# EAGLE design m1k-input-divider (EAGLE 7.7.0)
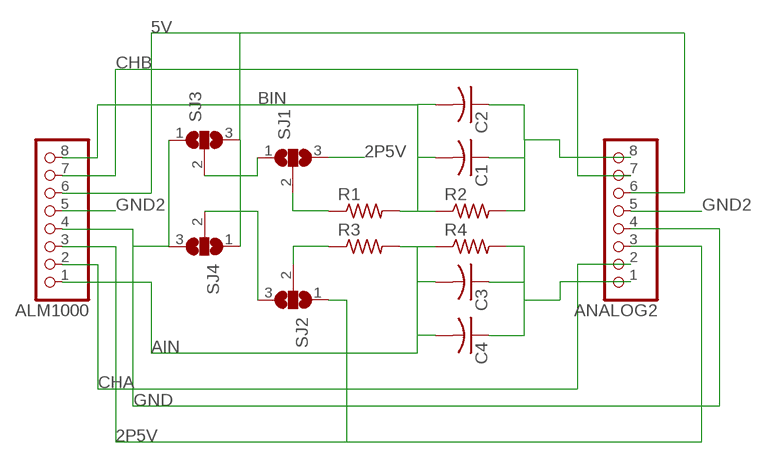
[diagram p0: schematic, sheet 1]

## Parts
ALM1000  PINHD-1X8  [1X08]
ANALOG2  PINHD-1X8  [1X08]
C1  C-US050-024X044  [C050-024X044]
C2  C-US050-024X044  [C050-024X044]
C3  C-US050-024X044  [C050-024X044]
C4  C-US050-024X044  [C050-024X044]
R1  R-US_0204/7  [0204/7]
R2  R-US_0204/7  [0204/7]
R3  R-US_0204/7  [0204/7]
R4  R-US_0204/7  [0204/7]
SJ1  SJ2W  [SJ_2]
SJ2  SJ2W  [SJ_2]
SJ3  SJ2W  [SJ_2]
SJ4  SJ2W  [SJ_2]

## Nets
2P5V: ALM1000.3 ANALOG2.3 SJ1.3 SJ2.1
5V: ALM1000.6 ANALOG2.6 SJ3.3 SJ4.1
AIN: ALM1000.1 C3.2 C4.2 R3.2 R4.1
BIN: ALM1000.8 C1.2 C2.2 R1.2 R2.1
CHA: ALM1000.2 ANALOG2.2
CHB: ALM1000.7 ANALOG2.7
GND: ALM1000.4 ANALOG2.4 SJ3.1 SJ4.3
GND2: ALM1000.5 ANALOG2.5
N$1: SJ1.1 SJ3.2
N$2: SJ2.3 SJ4.2
N$3: ANALOG2.1 C3.1 C4.1 R4.2
N$4: R1.1 SJ1.2
N$5: R3.1 SJ2.2
N$7: ANALOG2.8 C1.1 C2.1 R2.2

## Library data of the parts
ALM1000 ANALOG2 = pinhead:PINHD-1X8: PIN HEADER
C1-C4 = resistor:C-US: CAPACITOR, American symbol
R1-R4 = resistor:R-US_: RESISTOR, American symbol
SJ1-SJ4 = jumper:SJ2W: SMD solder JUMPER

## Board
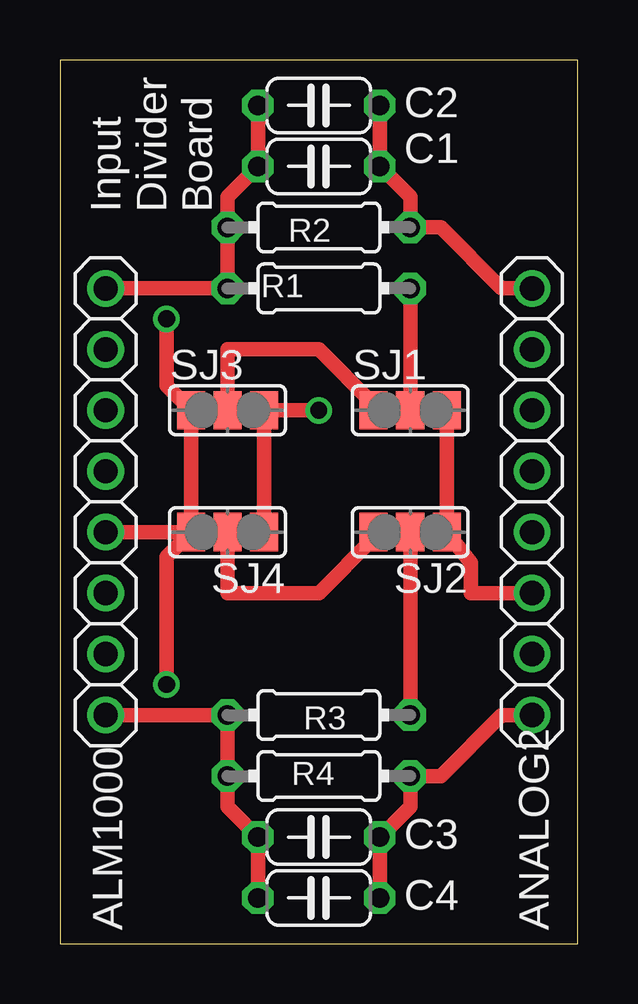
[diagram p1: board, top side]
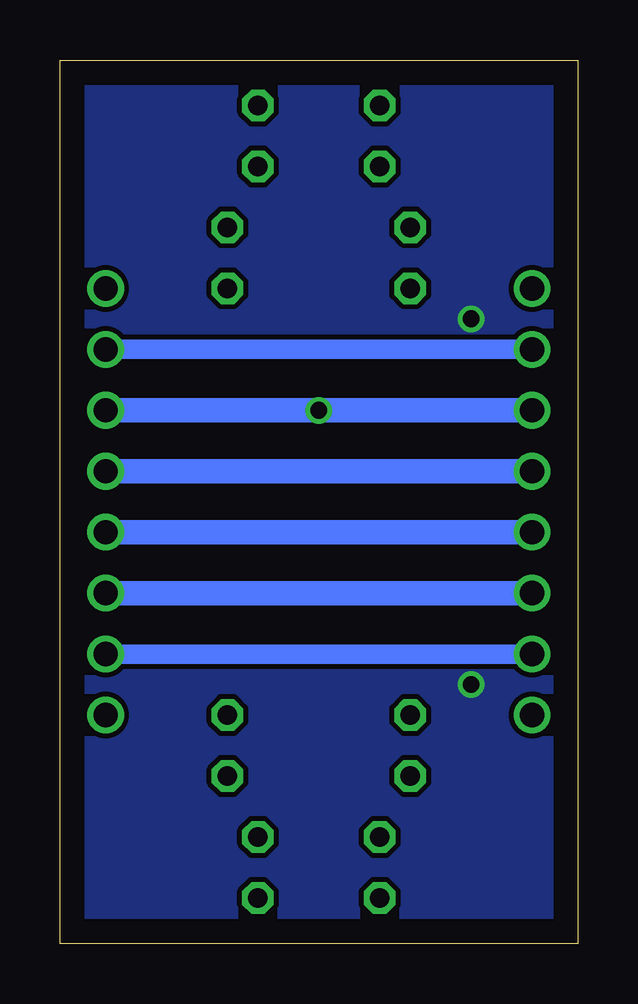
[diagram p2: board, bottom side, seen from below]

Size 21.59 x 36.82 mm. Coordinates in mm from the lower left corner, seen from the top.
Outline: 0,0 21.59,0 21.59,36.82 0,36.82 0,0
Copper layers (1*16): Top 0.035mm / dielectric 1.5mm / Bottom 0.035mm
Design rules "default": minimum track width 10mil, minimum drill 24mil, track to track 8mil, track to pad 8mil, pad to pad 8mil, via to via 8mil, smd to smd 8mil, copper to edge 40mil, drill to drill 8mil, minimum pad ring 10mil, minimum via ring 8mil, stop-mask expansion 4mil, vias tented up to drill 0mil, thermal gap 10mil

### Footprints (pad centres in the part's own frame; a part is rotated, then mirrored left to right if it is on the bottom)
1X08 = drill 1.016: 1 -8.89,0; 2 -6.35,0; 3 -3.81,0; 4 -1.27,0; 5 1.27,0; 6 3.81,0; 7 6.35,0; 8 8.89,0
C050-024X044 = drill 0.813 octagon: 1 -2.54,0; 2 2.54,0
0204/7 = drill 0.813 octagon: 1 -3.81,0; 2 3.81,0
SJ_2 = smd 1.168 x 1.6: 1 -1.524,0; 2 0,0; 3 1.524,0

### Placement (x,y rotation side)
ALM1000  1.91,18.41 90 top
ANALOG2  19.68,18.41 90 top
C1  10.79,32.38 180 top
C2  10.79,34.92 180 top
C3  10.79,4.45 180 top
C4  10.79,1.91 180 top
R1  10.79,27.3 180 top
R2  10.79,29.84 0 top
R3  10.79,9.53 180 top
R4  10.79,6.99 0 top
SJ1  14.61,22.23 0 top
SJ2  14.61,17.14 180 top
SJ3  6.99,22.23 0 top
SJ4  6.99,17.14 180 top

### Tracks (layer width: path | path; a pad name or v marks a point on that pad's centre or on a via)
2P5V
  Top 0.61: ANALOG2.3 17.14,14.61 17.14,15.88 SJ2.1 SJ1.3
  Bottom 1.016: ALM1000.3 ANALOG2.3
5V  (via drill 0.7)
  Top 0.61: v10.79,22.23 SJ3.3 SJ4.1
  Bottom 1.016: ALM1000.6 v10.79,22.23 ANALOG2.6
AIN
  Top 0.61: C4.2 C3.2 6.99,5.71 R4.1 R3.2 ALM1000.1
BIN
  Top 0.61: C2.2 C1.2 6.99,31.11 R2.1 R1.2 ALM1000.8
CHA
  Bottom 0.813: ALM1000.2 ANALOG2.2
CHB
  Bottom 0.813: ALM1000.7 ANALOG2.7
GND  (via drill 0.7)
  Top 0.61: 3.17,17.14 ALM1000.4 SJ4.3 | v4.45,10.79 4.45,16.13 SJ4.3 | SJ4.3 SJ3.1 4.45,23.24 v4.45,26.04
  Bottom 1.016: ALM1000.4 ANALOG2.4
  pour Bottom: 0.64,13.34 0.64,0.64 20.95,0.64 20.95,13.34
  pour Bottom: 0.64,36.2 0.64,23.5 20.95,23.5 20.95,36.2
GND2
  Bottom 1.016: ALM1000.5 ANALOG2.5
N$1
  Top 0.61: SJ1.1 13.08,22.48 10.79,24.77 6.99,24.77 SJ3.2
N$2
  Top 0.61: SJ2.3 13.08,16.89 10.79,14.61 6.99,14.61 SJ4.2
N$3
  Top 0.61: C4.1 C3.1 14.61,5.71 R4.2 15.88,6.99 18.41,9.53 ANALOG2.1
N$4
  Top 0.61: R1.1 SJ1.2
N$5
  Top 0.61: R3.1 SJ2.2
N$7
  Top 0.61: C2.1 C1.1 14.61,31.11 R2.2 15.88,29.84 18.41,27.3 ANALOG2.8

### Text on the board
tPlace: Input / Divider / Board